# EAGLE schematic SHiB64(Mk.1Mod.2) (EAGLE 9.6.0)
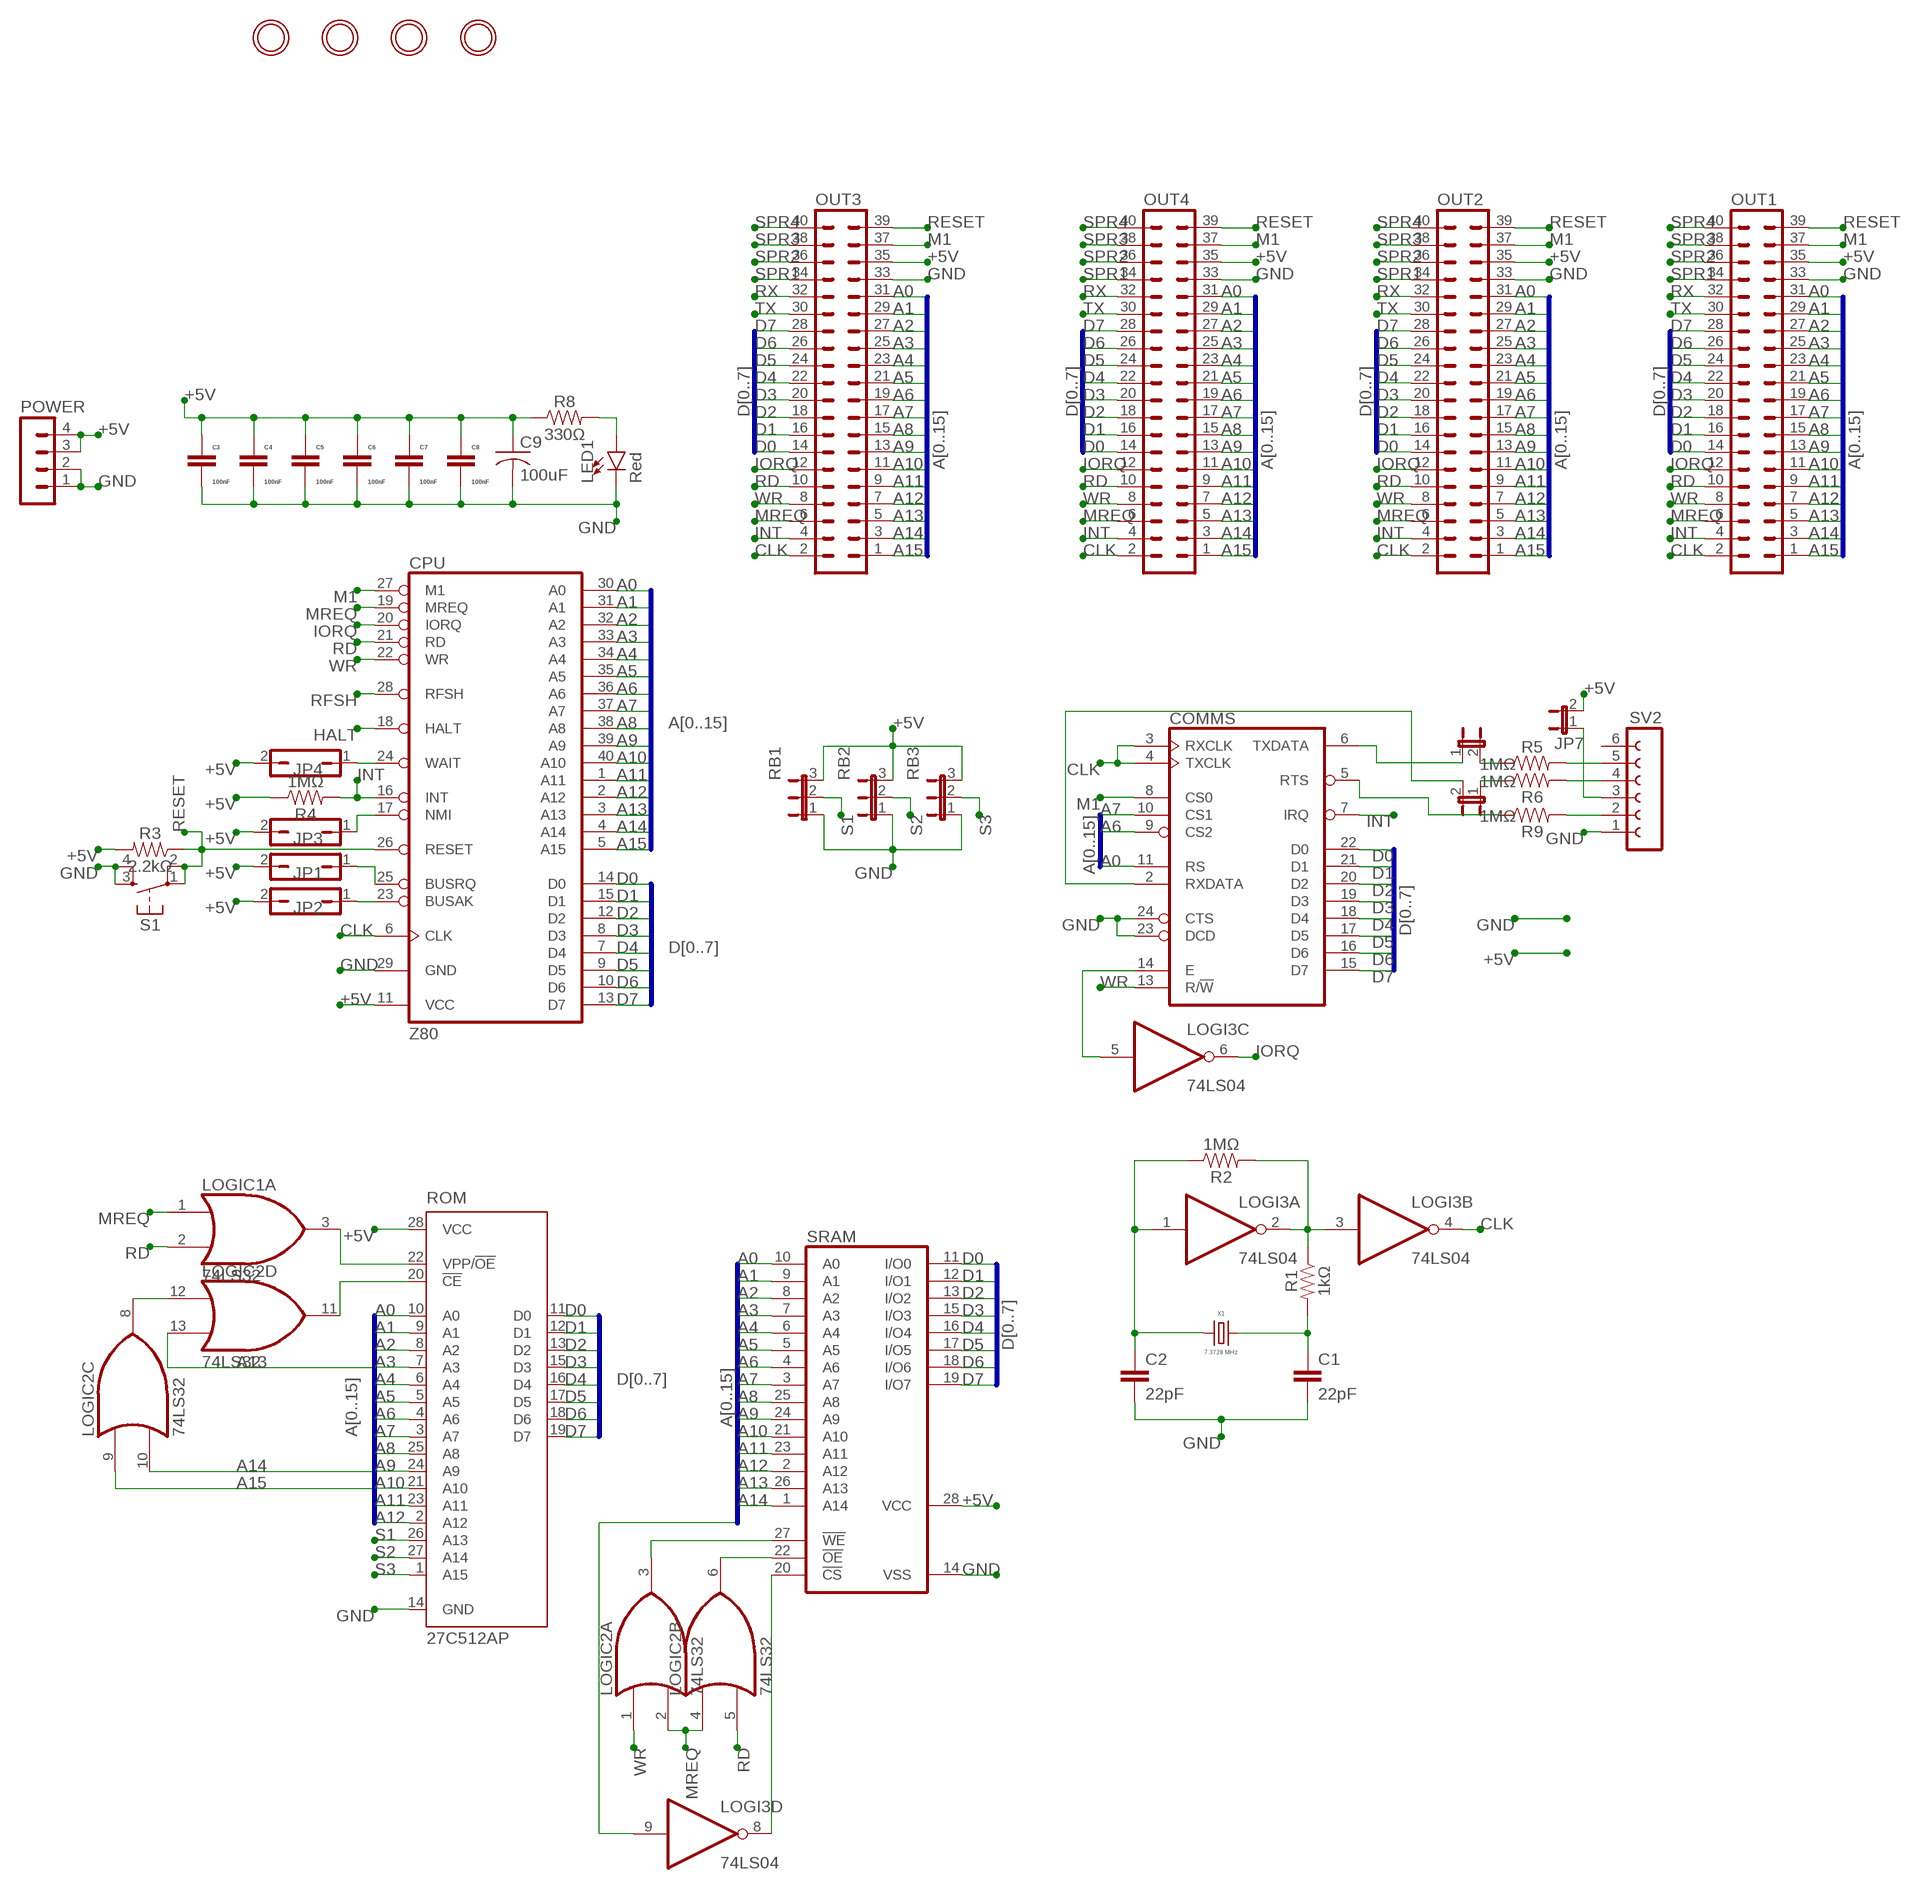
[diagram p0: schematic, sheet 1]

## Parts
C1  22pF  CAP_DISK  [CAP-PTH-2.54]
C2  22pF  CAP_DISK  [CAP-PTH-2.54]
C3  100nF  CAPACITOR_1206_NONPPOLAR  [C1206]
C4  100nF  CAPACITOR_1206_NONPPOLAR  [C1206]
C5  100nF  CAPACITOR_1206_NONPPOLAR  [C1206]
C6  100nF  CAPACITOR_1206_NONPPOLAR  [C1206]
C7  100nF  CAPACITOR_1206_NONPPOLAR  [C1206]
C8  100nF  CAPACITOR_1206_NONPPOLAR  [C1206]
C9  100uF  CAPACITOR_1206_POLAR  [C1206]
COMMS  6850  [DIL24]
CPU  Z80  Z80CPU  [DIL40]
JP1  JP1Q  [JP1]
JP2  JP1Q  [JP1]
JP3  JP1Q  [JP1]
JP4  JP1Q  [JP1]
JP5  JP1E  [JP1]
JP6  JP1E  [JP1]
JP7  JP1E  [JP1]
LED1  Red  LED_1206  [LED_1206]
LOGI3  74LS04  74ALS04D  [SO14]
LOGIC1  74LS32  74LS32D  [SO14]
LOGIC2  74LS32  74LS32D  [SO14]
OUT1  MA20-2  [MA20-2]
OUT2  MA20-2  [MA20-2]
OUT3  MA20-2  [MA20-2]
OUT4  MA20-2  [MA20-2]
POWER  MA04-1  [MA04-1]
R1  1kΩ  RESISTOR  [R1206]
R2  1MΩ  RESISTOR  [R1206]
R3  2.2kΩ  RESISTOR  [R1206]
R4  1MΩ  RESISTOR  [R1206]
R5  1MΩ  RESISTOR  [R1206]
R6  1MΩ  RESISTOR  [R1206]
R8  330Ω  RESISTOR  [R1206]
R9  1MΩ  RESISTOR  [R1206]
RB1  JP2E  [JP2]
RB2  JP2E  [JP2]
RB3  JP2E  [JP2]
ROM  27C512AP  [DIL28-6]
S1  MOMENTARY_BUTTONS6MMSMALL  [TACTILE_SWITCH_PTH_6.0MM]
SRAM  62256P  [DIL28-6]
SV2  FE06-1  [FE06]
U$1  MOUNTING_HOLE  [MOUNTINGHOLE_3.2MM_PLATEDTHIN]
U$2  MOUNTING_HOLE  [MOUNTINGHOLE_3.2MM_PLATEDTHIN]
U$3  MOUNTING_HOLE  [MOUNTINGHOLE_3.2MM_PLATEDTHIN]
U$4  MOUNTING_HOLE  [MOUNTINGHOLE_3.2MM_PLATEDTHIN]
X1  7.3728 MHz  CRYSTAL_16MHZ  [HC49US]

## Nets
+5V: C3.1 C4.1 C5.1 C6.1 C7.1 C8.1 C9.1 CPU.11(VCC) JP1.2 JP2.2 JP3.2 JP4.2 JP7.2 OUT1.35 OUT2.35 OUT3.35 OUT4.35 POWER.3 POWER.4 R3.2 R4.1 R8.1 RB1.3 RB2.3 RB3.3 ROM.28(VCC) SRAM.28(VCC)
A0: COMMS.11(RS) CPU.30(A0) OUT1.31 OUT2.31 OUT3.31 OUT4.31 ROM.10(A0) SRAM.10(A0)
A1: CPU.31(A1) OUT1.29 OUT2.29 OUT3.29 OUT4.29 ROM.9(A1) SRAM.9(A1)
A2: CPU.32(A2) OUT1.27 OUT2.27 OUT3.27 OUT4.27 ROM.8(A2) SRAM.8(A2)
A3: CPU.33(A3) OUT1.25 OUT2.25 OUT3.25 OUT4.25 ROM.7(A3) SRAM.7(A3)
A4: CPU.34(A4) OUT1.23 OUT2.23 OUT3.23 OUT4.23 ROM.6(A4) SRAM.6(A4)
A5: CPU.35(A5) OUT1.21 OUT2.21 OUT3.21 OUT4.21 ROM.5(A5) SRAM.5(A5)
A6: COMMS.9(CS2) CPU.36(A6) OUT1.19 OUT2.19 OUT3.19 OUT4.19 ROM.4(A6) SRAM.4(A6)
A7: COMMS.10(CS1) CPU.37(A7) OUT1.17 OUT2.17 OUT3.17 OUT4.17 ROM.3(A7) SRAM.3(A7)
A8: CPU.38(A8) OUT1.15 OUT2.15 OUT3.15 OUT4.15 ROM.25(A8) SRAM.25(A8)
A9: CPU.39(A9) OUT1.13 OUT2.13 OUT3.13 OUT4.13 ROM.24(A9) SRAM.24(A9)
A10: CPU.40(A10) OUT1.11 OUT2.11 OUT3.11 OUT4.11 ROM.21(A10) SRAM.21(A10)
A11: CPU.1(A11) OUT1.9 OUT2.9 OUT3.9 OUT4.9 ROM.23(A11) SRAM.23(A11)
A12: CPU.2(A12) OUT1.7 OUT2.7 OUT3.7 OUT4.7 ROM.2(A12) SRAM.2(A12)
A13: CPU.3(A13) LOGIC2.13(D:I1) OUT1.5 OUT2.5 OUT3.5 OUT4.5 SRAM.26(A13)
A14: CPU.4(A14) LOGIC2.10(C:I1) OUT1.3 OUT2.3 OUT3.3 OUT4.3 SRAM.1(A14)
A15: CPU.5(A15) LOGI3.9(D:I) LOGIC2.9(C:I0) OUT1.1 OUT2.1 OUT3.1 OUT4.1
CLK: COMMS.3(RXCLK) COMMS.4(TXCLK) CPU.6(CLK) LOGI3.4(B:O) OUT1.2 OUT2.2 OUT3.2 OUT4.2
D0: COMMS.22(D0) CPU.14(D0) OUT1.14 OUT2.14 OUT3.14 OUT4.14 ROM.11(D0) SRAM.11(I/O0)
D1: COMMS.21(D1) CPU.15(D1) OUT1.16 OUT2.16 OUT3.16 OUT4.16 ROM.12(D1) SRAM.12(I/O1)
D2: COMMS.20(D2) CPU.12(D2) OUT1.18 OUT2.18 OUT3.18 OUT4.18 ROM.13(D2) SRAM.13(I/O2)
D3: COMMS.19(D3) CPU.8(D3) OUT1.20 OUT2.20 OUT3.20 OUT4.20 ROM.15(D3) SRAM.15(I/O3)
D4: COMMS.18(D4) CPU.7(D4) OUT1.22 OUT2.22 OUT3.22 OUT4.22 ROM.16(D4) SRAM.16(I/O4)
D5: COMMS.17(D5) CPU.9(D5) OUT1.24 OUT2.24 OUT3.24 OUT4.24 ROM.17(D5) SRAM.17(I/O5)
D6: COMMS.16(D6) CPU.10(D6) OUT1.26 OUT2.26 OUT3.26 OUT4.26 ROM.18(D6) SRAM.18(I/O6)
D7: COMMS.15(D7) CPU.13(D7) OUT1.28 OUT2.28 OUT3.28 OUT4.28 ROM.19(D7) SRAM.19(I/O7)
GND: C1.2 C2.2 C3.2 C4.2 C5.2 C6.2 C7.2 C8.2 C9.2 COMMS.23(DCD) COMMS.24(CTS) CPU.29(GND) LED1.-(C) OUT1.33 OUT2.33 OUT3.33 OUT4.33 POWER.1 POWER.2 RB1.1 RB2.1 RB3.1 ROM.14(GND) S1.3(S) S1.4(S1) SRAM.14(VSS) SV2.1
HALT: CPU.18(HALT)
INT: COMMS.7(IRQ) CPU.16(INT) OUT1.4 OUT2.4 OUT3.4 OUT4.4 R4.2
IORQ: CPU.20(IORQ) LOGI3.6(C:O) OUT1.12 OUT2.12 OUT3.12 OUT4.12
M1: COMMS.8(CS0) CPU.27(M1) OUT1.37 OUT2.37 OUT3.37 OUT4.37
MREQ: CPU.19(MREQ) LOGIC1.1(A:I0) LOGIC2.2(A:I1) LOGIC2.4(B:I0) OUT1.6 OUT2.6 OUT3.6 OUT4.6
N$1: C1.1 R1.2 X1.2
N$2: C2.1 LOGI3.1(A:I) R2.1 X1.1
N$3: LOGI3.2(A:O) LOGI3.3(B:I) R1.1 R2.2
N$4: CPU.25(BUSRQ) JP1.1
N$5: CPU.23(BUSAK) JP2.1
N$6: CPU.17(NMI) JP3.1
N$7: CPU.24(WAIT) JP4.1
N$8: LOGIC1.3(A:O) ROM.22(VPP/!OE)
N$9: LOGIC2.11(D:O) ROM.20(!CE)
N$10: LOGIC2.8(C:O) LOGIC2.12(D:I0)
N$11: JP5.2 R5.1
N$12: COMMS.14(E) LOGI3.5(C:I)
N$13: JP6.1 R6.1
N$14: COMMS.6(TXDATA) JP5.1
N$15: R6.2 SV2.4
N$16: R5.2 SV2.5
N$17: COMMS.2(RXDATA) JP6.2
N$18: COMMS.5(RTS) R9.1
N$19: JP7.1 SV2.3
N$20: R9.2 SV2.2
N$21: LOGI3.8(D:O) SRAM.20(!CS)
N$22: LOGIC2.6(B:O) SRAM.22(!OE)
N$23: LOGIC2.3(A:O) SRAM.27(!WE)
N$26: LED1.+(A) R8.2
RD: CPU.21(RD) LOGIC1.2(A:I1) LOGIC2.5(B:I1) OUT1.10 OUT2.10 OUT3.10 OUT4.10
RESET: CPU.26(RESET) OUT1.39 OUT2.39 OUT3.39 OUT4.39 R3.1 S1.1(P) S1.2(P1)
RFSH: CPU.28(RFSH)
RX: OUT1.32 OUT2.32 OUT3.32 OUT4.32
S1: RB1.2 ROM.26(A13)
S2: RB2.2 ROM.27(A14)
S3: RB3.2 ROM.1(A15)
SPR1: OUT1.34 OUT2.34 OUT3.34 OUT4.34
SPR2: OUT1.36 OUT2.36 OUT3.36 OUT4.36
SPR3: OUT1.38 OUT2.38 OUT3.38 OUT4.38
SPR4: OUT1.40 OUT2.40 OUT3.40 OUT4.40
TX: OUT1.30 OUT2.30 OUT3.30 OUT4.30
WR: COMMS.13(R/!W) CPU.22(WR) LOGIC2.1(A:I0) OUT1.8 OUT2.8 OUT3.8 OUT4.8
Unconnected: LOGI3.10(E:O) LOGI3.11(E:I) LOGI3.12(F:O) LOGI3.13(F:I) LOGIC1.4(B:I0) LOGIC1.5(B:I1) LOGIC1.6(B:O) LOGIC1.8(C:O) LOGIC1.9(C:I0) LOGIC1.10(C:I1) LOGIC1.11(D:O) LOGIC1.12(D:I0) LOGIC1.13(D:I1) SV2.6

## Buses
D[0..7]
A[0..15]

## Power pins joined to a net without a drawn wire
GND: LOGI3.7(P:GND) LOGIC1.7(P:GND) LOGIC2.7(P:GND)
VCC: COMMS.12(VCC) LOGI3.14(P:VCC) LOGIC1.14(P:VCC) LOGIC2.14(P:VCC)
VSS: COMMS.1(VSS)

## Library data of the parts
C1 C2 = ACES_THT:CAP_DISK: Use for 0.1μF (103) and 0.01μF (104). Also suitable for 22ρF crystal filter caps for offboard ATmega328p.
C3-C8 = ACES_SMT:CAPACITOR_1206_NONPPOLAR
C9 = ACES_SMT:CAPACITOR_1206_POLAR
COMMS = micro-motorola:6850: MICROCONTROLLER/MEMORY DEVICE; MF: NTE ELECTRONICS; MPN: NTE6850; OC_FARNELL: 4899775; OC_NEWARK: 31C2457
CPU = zilog:Z80CPU: Z80 FAMILY DEVICE
JP1-JP4 = jumper:JP1Q: JUMPER
JP5-JP7 = jumper:JP1E: JUMPER
LED1 = ACES_SMT:LED_1206
LOGI3 = 74xx-us:74*04: Hex INVERTER
LOGIC1 LOGIC2 = 74xx-us:74*32: Quad 2-input OR gate
OUT1-OUT4 = con-lstb:MA20-2: PIN HEADER; OC_FARNELL: unknown; OC_NEWARK: unknown
POWER = con-lstb:MA04-1: PIN HEADER; OC_FARNELL: unknown; OC_NEWARK: unknown
R1-R6 R8 R9 = ACES_SMT:RESISTOR
RB1-RB3 = jumper:JP2E: JUMPER
ROM = microchip:27*512A: CMOS EPROM 512 K (64 K x 8); MPN: M27C512-90B6; OC_FARNELL: 1642690; OC_NEWARK: 20M6389
S1 = ACES_THT:MOMENTARY_BUTTONS: OMRON SWITCH
SRAM = memory-hitachi:62256P: MEMORY
SV2 = con-lsta:FE06-1: FEMALE HEADER; OC_FARNELL: unknown; OC_NEWARK: unknown
U$1-U$4 = ACES_THT:MOUNTING_HOLE: For consistency, ACES use 3mm screws <https://www.mcmaster.com/92492a715> and heat set inserts <https://www.mcmaster.com/94180a333> from McMaster-Carr for their PCB and Case designs. These holes were ported from the microbuilder library and offer no ground protection as we typically use nylon hardware. You are encouraged to use this these mounting holes for your PCB designs.
X1 = ACES_THT:CRYSTAL_16MHZ